# EAGLE design csgo_gsi (EAGLE 9.5.2)
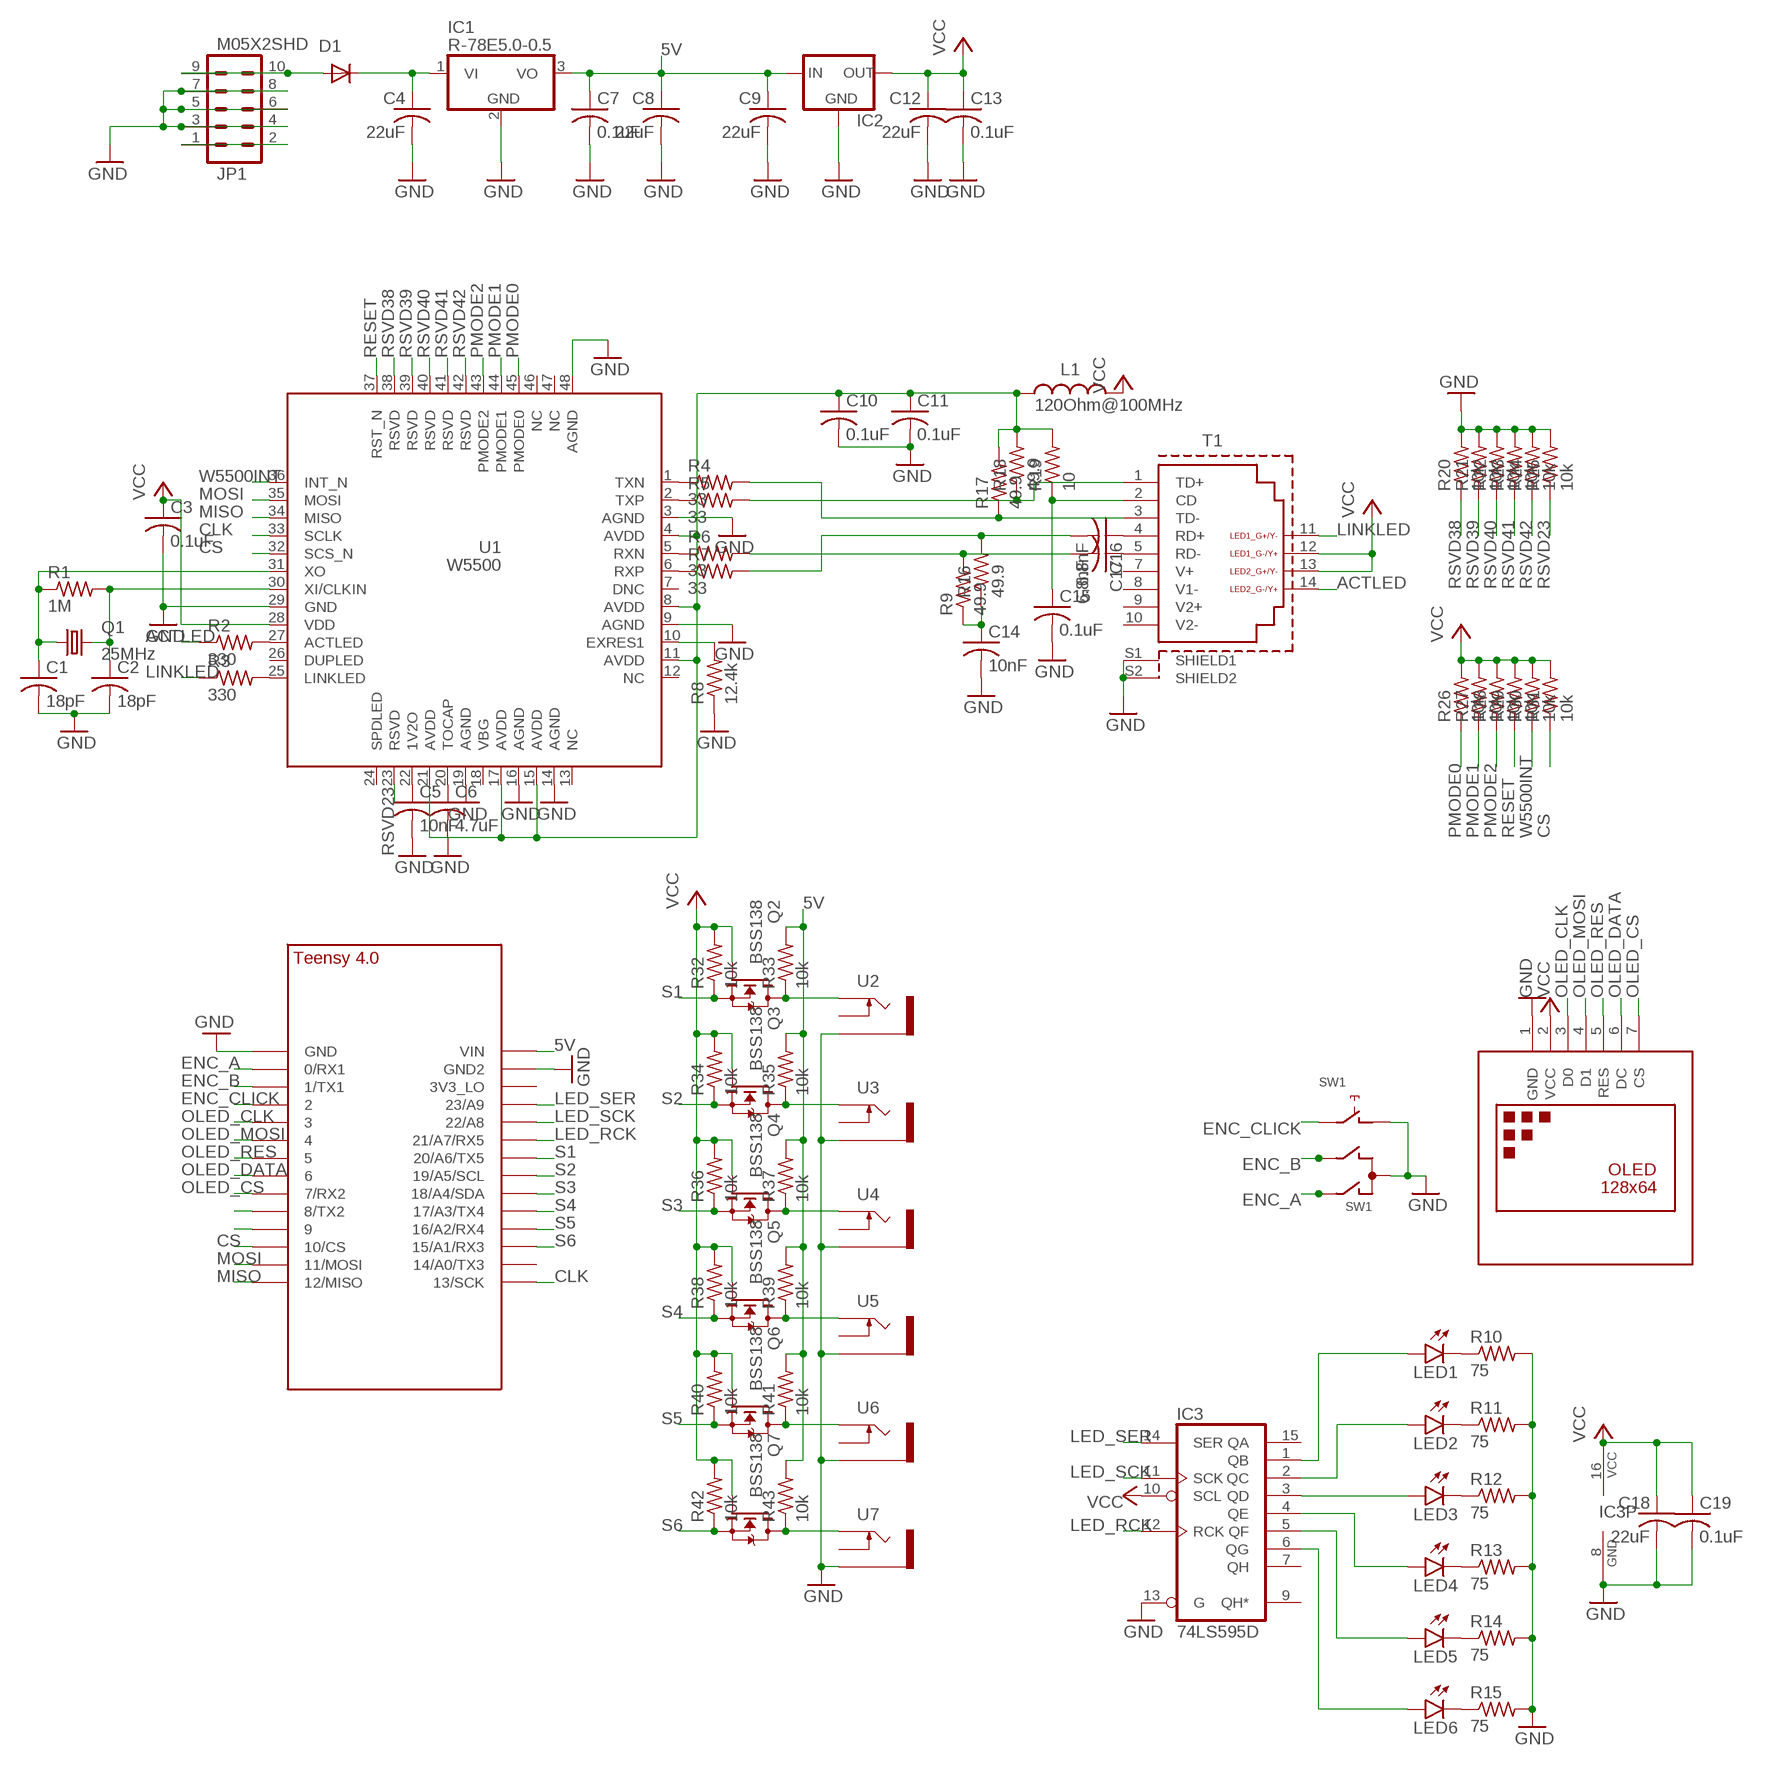
[diagram p0: schematic, sheet 1]

## Parts
C1  18pF  C-USC0603  [C0603]
C2  18pF  C-USC0603  [C0603]
C3  0.1uF  C-USC0603  [C0603]
C4  22uF  C-USC1206  [C1206]
C5  10nF  C-USC0603  [C0603]
C6  4.7uF  C-USC0603  [C0603]
C7  0.1uF  C-USC0603  [C0603]
C8  22uF  C-USC1206  [C1206]
C9  22uF  C-USC1206  [C1206]
C10  0.1uF  C-USC0603  [C0603]
C11  0.1uF  C-USC0603  [C0603]
C12  22uF  C-USC1206  [C1206]
C13  0.1uF  C-USC0603  [C0603]
C14  10nF  C-USC0603  [C0603]
C15  0.1uF  C-USC0603  [C0603]
C16  6.8nF  C-USC0603  [C0603]
C17  6.8nF  C-USC0603  [C0603]
C18  22uF  C-USC1206  [C1206]
C19  0.1uF  C-USC0603  [C0603]
D1  1N5819HW  DIODE-SOD123  [SOD123]
IC1  R-78E5.0-0.5  WE173950378  [WE78]
IC2  LM1117  [SOT223]
IC3  74LS595D  [SO16]
JP1  M05X2SHD  [2X5-SHROUDED]
L1  120Ohm@100MHz  WE-CBF_0603_74279262_WB_HS  [WE-CBF_0603(W=2.2)]
LED1  LED3MM  [LED3MM]
LED2  LED3MM  [LED3MM]
LED3  LED3MM  [LED3MM]
LED4  LED3MM  [LED3MM]
LED5  LED3MM  [LED3MM]
LED6  LED3MM  [LED3MM]
OLED1  DISPLAY-OLED-128X64  [DISPLAY-OLED-128X64]
Q1  25MHz  KX-7  [3.2X2.5_KX-7]
Q2  BSS138  [SOT23]
Q3  BSS138  [SOT23]
Q4  BSS138  [SOT23]
Q5  BSS138  [SOT23]
Q6  BSS138  [SOT23]
Q7  BSS138  [SOT23]
R1  1M  R-US_R0603  [R0603]
R2  330  R-US_R0603  [R0603]
R3  330  R-US_R0603  [R0603]
R4  33  R-US_R0603  [R0603]
R5  33  R-US_R0603  [R0603]
R6  33  R-US_R0603  [R0603]
R7  33  R-US_R0603  [R0603]
R8  12.4k  R-US_R0603  [R0603]
R9  49.9  R-US_R0603  [R0603]
R10  75  R-US_R0603  [R0603]
R11  75  R-US_R0603  [R0603]
R12  75  R-US_R0603  [R0603]
R13  75  R-US_R0603  [R0603]
R14  75  R-US_R0603  [R0603]
R15  75  R-US_R0603  [R0603]
R16  49.9  R-US_R0603  [R0603]
R17  49.9  R-US_R0603  [R0603]
R18  49.9  R-US_R0603  [R0603]
R19  10  R-US_R0603  [R0603]
R20  10k  R-US_R0603  [R0603]
R21  10k  R-US_R0603  [R0603]
R22  10k  R-US_R0603  [R0603]
R23  10k  R-US_R0603  [R0603]
R24  10k  R-US_R0603  [R0603]
R25  10k  R-US_R0603  [R0603]
R26  10k  R-US_R0603  [R0603]
R27  10k  R-US_R0603  [R0603]
R28  10k  R-US_R0603  [R0603]
R29  10k  R-US_R0603  [R0603]
R30  10k  R-US_R0603  [R0603]
R31  10k  R-US_R0603  [R0603]
R32  10k  R-US_R0603  [R0603]
R33  10k  R-US_R0603  [R0603]
R34  10k  R-US_R0603  [R0603]
R35  10k  R-US_R0603  [R0603]
R36  10k  R-US_R0603  [R0603]
R37  10k  R-US_R0603  [R0603]
R38  10k  R-US_R0603  [R0603]
R39  10k  R-US_R0603  [R0603]
R40  10k  R-US_R0603  [R0603]
R41  10k  R-US_R0603  [R0603]
R42  10k  R-US_R0603  [R0603]
R43  10k  R-US_R0603  [R0603]
SW1  Encoder  EC12E_SW  [ALPS_EC12E_SW]
T1  WE-RJ45_74984104401  [74984104401]
U1  W5500  [W5500]
U2  THONKICONNNEW  [WQP-PJ301M-12_JACK]
U3  THONKICONNNEW  [WQP-PJ301M-12_JACK]
U4  THONKICONNNEW  [WQP-PJ301M-12_JACK]
U5  THONKICONNNEW  [WQP-PJ301M-12_JACK]
U6  THONKICONNNEW  [WQP-PJ301M-12_JACK]
U7  THONKICONNNEW  [WQP-PJ301M-12_JACK]
U$1  TEENSY_4.0-BASIC  [TEENSY_4.0-BASIC]

## Nets
5V: C7.1 C8.1 C9.1 IC1.3(VO) IC2.3(IN) R33.2 R35.2 R37.2 R39.2 R41.2 R43.2 U$1.VIN
12V: C4.1 D1.C IC1.1(VI)
ACTLED: R2.1 T1.14(LED2_Y+/G-)
CLK: U1.33(SCLK) U$1.13/SCK
CS: R31.1 U1.32(SCS_N) U$1.10/CS
ENC_A: SW1.A U$1.0/RX(0/RX1)
ENC_B: SW1.B U$1.1/TX(1/TX1)
ENC_CLICK: SW1.E U$1.2
GND: C1.2 C2.2 C3.2 C4.2 C5.2 C6.2 C7.2 C8.2 C9.2 C10.2 C11.2 C12.2 C13.2 C14.2 C15.2 C18.2 C19.2 IC1.2(GND) IC2.1(GND) IC3.8(GND) IC3.13(G) JP1.3 JP1.4 JP1.5 JP1.6 JP1.7 JP1.8 OLED1.1(GND) R8.1 R10.2 R11.2 R12.2 R13.2 R14.2 R15.2 R20.2 R21.2 R22.2 R23.2 R24.2 R25.2 SW1.C SW1.D T1.S1(SHIELD1) T1.S2(SHIELD2) U1.3(AGND) U1.9(AGND) U1.14(AGND) U1.16(AGND) U1.19(AGND) U1.29(GND) U1.48(AGND) U2.P$3_SLEEVE(SLEEVE) U3.P$3_SLEEVE(SLEEVE) U4.P$3_SLEEVE(SLEEVE) U5.P$3_SLEEVE(SLEEVE) U6.P$3_SLEEVE(SLEEVE) U7.P$3_SLEEVE(SLEEVE) U$1.GND
LED1: IC3.1(QB) LED1.A
LED2: IC3.2(QC) LED2.A
LED3: IC3.3(QD) LED3.A
LED4: IC3.4(QE) LED4.A
LED5: IC3.5(QF) LED5.A
LED6: IC3.6(QG) LED6.A
LED_RCK: IC3.12(RCK) U$1.21/A7(21/A7/RX5)
LED_SCK: IC3.11(SCK) U$1.22/A8
LED_SER: IC3.14(SER) U$1.23/A9
LINKLED: R3.1 T1.11(LED1_Y-/G+)
MISO: U1.34(MISO) U$1.12/MISO
MOSI: U1.35(MOSI) U$1.11/MOSI
N$1: C5.1 U1.22(1V2O)
N$2: C6.1 U1.20(TOCAP)
N$3: R5.2 R18.1 T1.1(TD+)
N$4: R4.2 R17.1 T1.3(TD-)
N$5: R3.2 U1.25(LINKLED)
N$6: R2.2 U1.27(ACTLED)
N$7: R8.2 U1.10(EXRES1)
N$8: R4.1 U1.1(TXN)
N$9: R5.1 U1.2(TXP)
N$10: R6.1 U1.5(RXN)
N$11: R7.1 U1.6(RXP)
N$12: C16.1 T1.4(RD+)
N$13: C17.1 T1.5(RD-)
N$14: C16.2 R7.2 R16.2
N$15: C17.2 R6.2 R9.2
N$16: C14.1 R9.1 R16.1
N$17: C1.1 Q1.1 R1.1 U1.31(XO)
N$18: C15.1 R19.1 T1.2(CD)
N$19: C10.1 C11.1 L1.1 R17.2 R18.2 R19.2 U1.4(AVDD) U1.8(AVDD) U1.11(AVDD) U1.15(AVDD) U1.17(AVDD) U1.21(AVDD)
N$20: C2.1 Q1.3 R1.2 U1.30(XI/CLKIN)
N$21: U$1.GND2 ; supply symbol labelled GND
N$22: LED1.K(C) R10.1
N$23: Q2.3(D) R33.1 U2.P$1_TIP(TIP)
N$24: LED2.K(C) R11.1
N$25: Q3.3(D) R35.1 U3.P$1_TIP(TIP)
N$26: LED3.K(C) R12.1
N$27: Q4.3(D) R37.1 U4.P$1_TIP(TIP)
N$28: LED4.K(C) R13.1
N$29: Q5.3(D) R39.1 U5.P$1_TIP(TIP)
N$30: LED5.K(C) R14.1
N$31: Q6.3(D) R41.1 U6.P$1_TIP(TIP)
N$32: LED6.K(C) R15.1
N$33: Q7.3(D) R43.1 U7.P$1_TIP(TIP)
N$42: U$1.8(8/TX2)
N$43: U$1.9/CS
N$56: D1.A JP1.9 JP1.10
N$64: JP1.1 JP1.2
OLED_CLK: OLED1.3(D0) U$1.3/CANTX
OLED_CS: OLED1.7(CS) U$1.7(7/RX2)
OLED_DATA: OLED1.6(DC) U$1.6
OLED_MOSI: OLED1.4(D1) U$1.4/CANRX
OLED_RES: OLED1.5(RES) U$1.5
PMODE0: R26.1 U1.45(PMODE0)
PMODE1: R27.1 U1.44(PMODE1)
PMODE2: R28.1 U1.43(PMODE2)
RESET: R29.1 U1.37(RST_N)
RSVD23: R25.1 U1.23(RSVD)
RSVD38: R20.1 U1.38(RSVD)
RSVD39: R21.1 U1.39(RSVD)
RSVD40: R22.1 U1.40(RSVD)
RSVD41: R23.1 U1.41(RSVD)
RSVD42: R24.1 U1.42(RSVD)
S1: Q2.2(S) R32.1 U$1.20/A6(20/A6/TX5)
S2: Q3.2(S) R34.1 U$1.19/A5/SCL
S3: Q4.2(S) R36.1 U$1.18/A4/SDA
S4: Q5.2(S) R38.1 U$1.17/A3(17/A3/TX4)
S5: Q6.2(S) R40.1 U$1.16/A2(16/A2/RX4)
S6: Q7.2(S) R42.1 U$1.15/A1(15/A1/RX3)
VCC: C3.1 C12.1 C13.1 C18.1 C19.1 IC2.2(OUT) IC3.10(SCL) IC3.16(VCC) L1.2 OLED1.2(VCC) Q2.1(G) Q3.1(G) Q4.1(G) Q5.1(G) Q6.1(G) Q7.1(G) R26.2 R27.2 R28.2 R29.2 R30.2 R31.2 R32.2 R34.2 R36.2 R38.2 R40.2 R42.2 T1.12(LED1_Y+/G-) T1.13(LED2_Y-/G+) U1.28(VDD)
W5500INT: R30.1 U1.36(INT_N)
Unconnected: IC3.7(QH) IC3.9(QH*) IC3.15(QA) SW1.GND1(G) SW1.GND2(G) T1.7(V+) T1.8(V1-) T1.9(V2+) T1.10(V2-) U1.7(DNC) U1.12(NC) U1.13(NC) U1.18(VBG) U1.24(SPDLED) U1.26(DUPLED) U1.46(NC) U1.47(NC) U2.P$2_SWITCH(SWITCH) U3.P$2_SWITCH(SWITCH) U4.P$2_SWITCH(SWITCH) U5.P$2_SWITCH(SWITCH) U6.P$2_SWITCH(SWITCH) U7.P$2_SWITCH(SWITCH) U$1.3V3_LO U$1.14/A0(14/A0/TX3)

## Library data of the parts
C1-C3 C5-C7 C10 C11 C13-C17 C19 = rcl:C-US: CAPACITOR, American symbol; SPICEPREFIX: C
C4 C8 C9 C12 C18 = rcl:C-US: CAPACITOR, American symbol
D1 = diode:DIODE-: DIODE
IC1 = og-vreg:WE173950378
IC2 = v-reg-3:LM1117
IC3 = 74xx-us:74*595: 8-bit SHIFT REGISTER, output latch
JP1 = og-header:M05X2: Header 5x2 Standard 10-pin dual row 0.1" header. Commonly used with AVR-ISP. Use with Spark Fun Electronics SKU: PRT-00778
L1 = o160525v244 Eagle_WE-CBF (rev19b):WE-CBF_0603: WE-CBF SMD EMI Suppression Ferrite Bead Characteristics Reliable Ni-Sn electrodes High rated current up to 6 A Operating temperature: –55 ºC to +125 ºC Applications Perfect as data lined filter and for uncoupling of distribution voltage Package name and Variant abbreviation: Package: Wide Band /High Speed: W=Width= 2.2 High Current: W=Width= 2.6 Variant abbreviation: WB = Wide Band HS=High Speed HC=High Current <https://katalog.we-online.de/media/images/v2/o14753v209%20Family_WE-CBF.jpg> Details see: http://katalog.we-online.de/en/pbs/WE-CBF Updated by Ella Wu 2019-01-02 2019 (C) Wurth Elektronik; DATASHEET-URL: https://www.we-online.com/catalog/datasheet/74279262.pdf; IR1: 500mA; IR2: 1350mA; MOUNT: SMT; PART-NUMBER: 74279262; RDC-MAX: 0.3Ohm; TYPE: Wide Band; Z: 141Ohm@1GMHz; ZMAX: 200Ohm
LED1-LED6 = led:LED: LED OSRAM: - CHIPLED LG R971, LG N971, LY N971, LG Q971, LY Q971, LO R971, LY R971 LH N974, LH R974 LS Q976, LO Q976, LY Q976 LO Q996 - Hyper CHIPLED LW Q18S LB Q993, LB Q99A, LB R99A - SideLED LS A670, LO A670, LY A670, LG A670, LP A670 LB A673, LV A673, LT A673, LW A673 LH A674 LY A675 LS A676, LA A676, LO A676, LY A676, LW A676 LS A679, LY A679, LG A679 - Hyper Micro SIDELED® LS Y876, LA Y876, LO Y876, LY Y876 LT Y87S - SmartLED LW L88C, LW L88S LB L89C, LB L89S, LG L890 LS L89K, LO L89K, LY L89K LS L896, LA L896, LO L896, LY L896 - TOPLED LS T670, LO T670, LY T670, LG T670, LP T670 LSG T670, LSP T670, LSY T670, LOP T670, LYG T670 LG T671, LOG T671, LSG T671 LB T673, LV T673, LT T673, LW T673 LH T674 LS T676, LA T676, LO T676, LY T676, LB T676, LH T676, LSB T676, LW T676 LB T67C, LV T67C, LT T67C, LS T67K, LO T67K, LY T67K, LW E67C LS E67B, LA E67B, LO E67B, LY E67B, LB E67C, LV E67C, LT E67C LW T67C LS T679, LY T679, LG T679 LS T770, LO T770, LY T770, LG T770, LP T770 LB T773, LV T773, LT T773, LW T773 LH T774 LS E675, LA E675, LY E675, LS T675 LS T776, LA T776, LO T776, LY T776, LB T776 LHGB T686 LT T68C, LB T68C - Hyper Mini TOPLED® LB M676 - Mini TOPLED Santana® LG M470 LS M47K, LO M47K, LY M47K Source: http://www.osram.convergy.de LUXEON: - LUMILED® LXK2-PW12-R00, LXK2-PW12-S00, LXK2-PW14-U00, LXK2-PW14-V00 LXK2-PM12-R00, LXK2-PM12-S00, LXK2-PM14-U00 LXK2-PE12-Q00, LXK2-PE12-R00, LXK2-PE12-S00, LXK2-PE14-T00, LXK2-PE14-U00 LXK2-PB12-K00, LXK2-PB12-L00, LXK2-PB12-M00, LXK2-PB14-N00, LXK2-PB14-P00, LXK2-PB14-Q00 LXK2-PR12-L00, LXK2-PR12-M00, LXK2-PR14-Q00, LXK2-PR14-R00 LXK2-PD12-Q00, LXK2-PD12-R00, LXK2-PD12-S00 LXK2-PH12-R00, LXK2-PH12-S00 LXK2-PL12-P00, LXK2-PL12-Q00, LXK2-PL12-R00 Source: www.luxeon.com KINGBRIGHT: KA-3528ASYC Source: www.kingbright.com
OLED1 = diy-modules:DISPLAY-OLED-128X64: 128x64 Dot Matrix OLED Module based on SSD1306 chip Variant with SPI interface More details available here: http://www.instructables.com/id/How-to-use-OLED-display-arduino-module/ SSD1306 datasheet: https://cdn-shop.adafruit.com/datasheets/SSD1306.pdf Click here to find device on ebay.com <http://www.ebay.com/sch/oled+display+128x64> Note: There are two variants: I2C and SPI. Search for the proper version.
Q1 = crystal-geyer_V1_0:KX: Quartz Crystals (MHz) SMD: KX - Serie Model Size l/w/h [mm] Frequency Range Frequency Stability Temp. Range [°C] Load Capacitance AECQ 200 availabel Datasheet KX-4 KX-5 KX-6 KX-7 KX-9A KX-9B KX-12A KX-12B KX-13 KX-20 KX-K KX-KS 1.6/1.2/0.3 2.0/1.6/0.45 2.5/2.0/0.55 3.2/2.5/0.8 5.0/3.2/1.0 5.0/3.2/1.1 6.0/3.5/1.1 6.0/3.5/1.0 7.0/5.0 /1.3 11.6/5.5/1.6 12.3/4.5/4.2 12.3/4.5/3.2 24.0 ~ 80.0 MHz 16.0 ~ 80.0 MHz 12.0 ~ 80.0 MHz 8.0 ~ 60.0 MHz 7,68 ~ 300,0 MHz 8,0 ~ 50,0 MHz 8,0 ~ 150,0 MHz 8,0 ~ 50,0 MHz 6,0 ~ 160,0 MHz 3,579 ~ 25,0 MHz 3,579 ~ 70,0 MHz 3,579 ~ 70,0 MHz ±10 … ±50ppm ±10 … ±50ppm ±10 … ±50ppm ±10 … ±50ppm ±10 … ±50ppm ±10 … ±50ppm ±10 … ±50ppm ±10 … ±50ppm ±10 … ±50ppm ±50ppm ±10 … ±50ppm ±10 … ±50ppm (*) -40°C …+85°C (*) -40°C …+125°C (*) -40°C …+125°C (*) -40°C …+125°C (*) -40°C …+105°C (*) -40°C …+105°C (*) -40°C …+125°C (*) -40°C …+105°C (*) -40°C …+105°C (*) -40°C …+105°C (*) -40°C …+85°C (*) -40°C …+85°C 8, 8…16 8, 8…16 10, 8…16 12, 7…20 16, 10…20 16, 10…20 16, 10…20 16, 12…20 16, 12…20 16, 12…20 16, 12…30 16, 12…30 - yes yes yes - - - - - - - - KX-4.pdf <http://www.geyer-electronic.de/uploads/tx_userartikelfrequenz/GEYER-KX-4.pdf> KX-5.pdf <http://www.geyer-electronic.de/uploads/tx_userartikelfrequenz/GEYER-KX-5.pdf> KX-6.pdf <http://www.geyer-electronic.de/uploads/tx_userartikelfrequenz/GEYER-KX-6.pdf> KX-7.pdf <http://www.geyer-electronic.de/uploads/tx_userartikelfrequenz/GEYER-KX-7.pdf> KX-9A.pdf <http://www.geyer-electronic.de/uploads/tx_userartikelfrequenz/GEYER-KX-9A.pdf> KX-9B.pdf <http://www.geyer-electronic.de/uploads/tx_userartikelfrequenz/GEYER-KX-9B.pdf> KX-12A.pdf <http://www.geyer-electronic.de/uploads/tx_userartikelfrequenz/GEYER-KX-12A.pdf> KX-12B.pdf <http://www.geyer-electronic.de/uploads/tx_userartikelfrequenz/GEYER-KX-12B.pdf> KX-13.pdf <http://www.geyer-electronic.de/uploads/tx_userartikelfrequenz/GEYER-KX-13.pdf> KX-20.pdf <http://www.geyer-electronic.de/uploads/tx_userartikelfrequenz/GEYER-KX-20.pdf> KX-K.pdf <http://www.geyer-electronic.de/uploads/tx_userartikelfrequenz/GEYER-KX-K.pdf> KX-KS.pdf <http://www.geyer-electronic.de/uploads/tx_userartikelfrequenz/GEYER-KX-KS.pdf> <http://www.geyer-electronic.de/fileadmin/template/img/logo-geyer-electronic.png> Details see: http://www.geyer-electronic.de/Frequenz-Produkte.9.0.html Created 2016-06-07, Hans Locher 2016 (C) Geyer Quartz Technology KX4,KX5,KX6,KX7,KX9A,KX9B,KX12A,KX12B,KX13,KX20,KXK,KXKS;1612;2016;2520;3225;5032;6035;7050;11655;12345;1,6x1,2;2,0x1,6;2,5x2,0;3,2x2,5;5,0x3,2;6,0x3,5;7,0x5,0;11,6x5,5;12,3x4,5;12,3x4,5;1.6x1.2;2.0x1.6;2.5x2.0;3.2x2.5;5.0x3.2;6.0x3.5;7.0x5.0;11.6x5.5;12.3x4.5;12.3x4.5;
Q2-Q7 = bss138_10:BSS138: BSS138 N-Channel Logic Level Enhancement Mode Field Effect Transistor Source: http://www.fairchildsemi.com/datasheets/BS/BSS138.pdf; MF: Fairchild; MPN: BSS138; OC_FARNELL: 9845330; OC_NEWARK: 67R2009
R1-R43 = rcl:R-US_: RESISTOR, American symbol; SPICEPREFIX: R
SW1 = switch-alps:EC12E_SW: ALPS rotary Encoder EC12E series with switch
T1 = o160650v244 Eagle_WE-RJ45 (rev19b):WE-RJ45_74984104401: WE-RJ45 LAN Transformer Characteristics RJ45 Connector with integrated transformer / common mode choke Power over Ethernet up to 50 Watt and speeds up to 10 Gbit/s Available in SMD, THT and THT with USB Compliant with standards: IEEE 802.3u, IEEE 802.3ab, IEEE 802.3af, IEEE 802.3at, IEEE 802.3an and upcoming IEE 802.3bt Applications Suitable for industrial temperatures from –40 °C up to +85 °C Compatible to Industrial Ethernet systems like EtherCAT or Profinet Compliant with most IC’s for Ethernet applications such as Microchip, Texas Instruments, Broadcom, Linear Technology Hubs, Routers, Switches, IP cameras, IoT applications <https://katalog.we-online.com/media/images/v2/o35731v209%20Family_WE-RJ45-LAN.jpg> Details see: https://katalog.we-online.com/en/pbs/WE-LAN-RJ45 Updated by Ella Wu 2019-11-06 2019 (C) Wurth Elektronik; DATA-RATE: 10/100 Base-T; DATASHEET-URL: https://katalog.we-online.com/pbs/datasheet/74984104401.pdf; LED: yellow/green-yellow/green; MOUNT: THR; PART-NUMBER: 74984104401; POE: 1; PORTS: PoE+ (up to 600 mA); SPICEPREFIX: X; USB: No
U1 = W5500:W5500
U2-U7 = MusicThingModular:THONKICONN: 3.5mm socket for Eurorack modular synths
U$1 = Teensy-4.0:TEENSY_4.0-BASIC

## Board
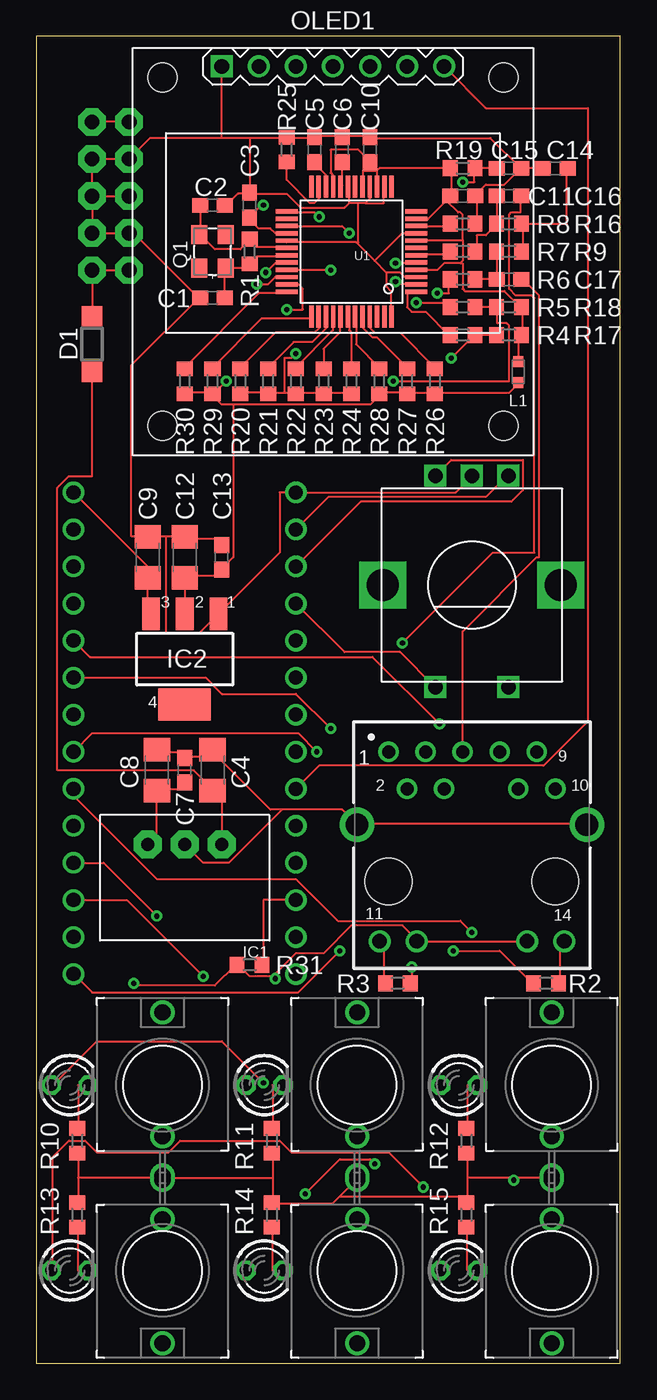
[diagram p1: board, top side]
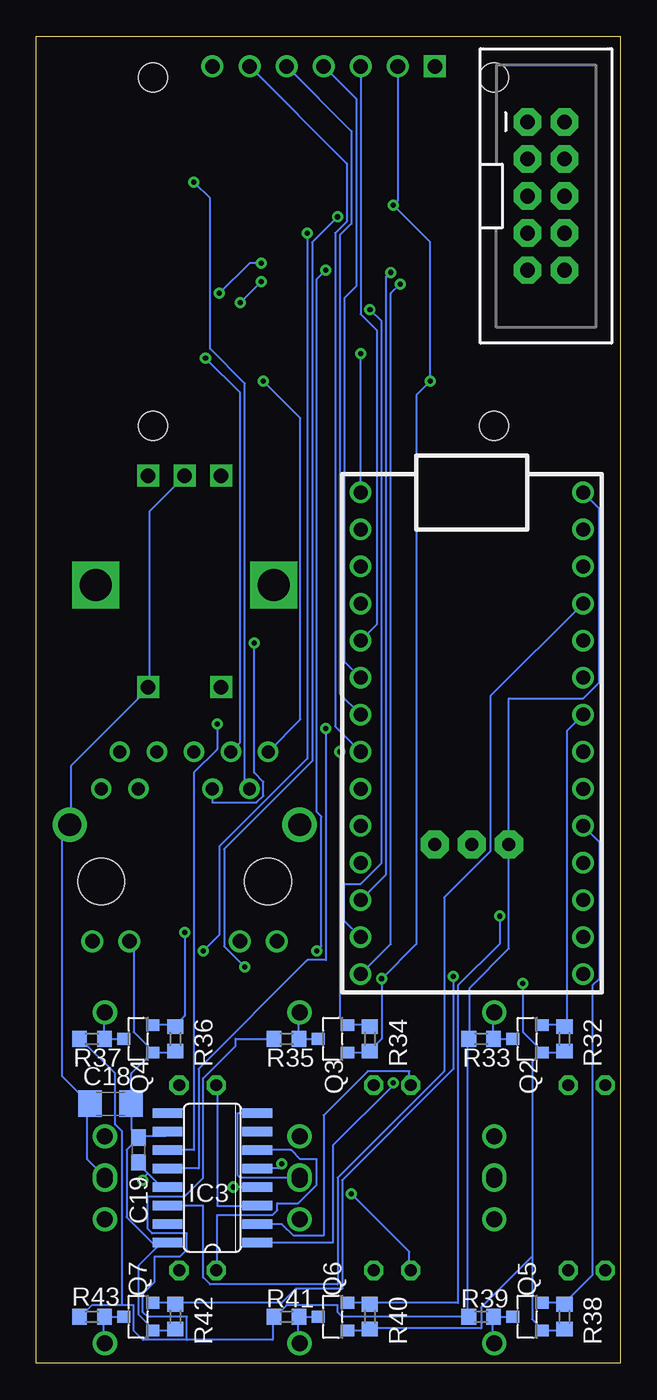
[diagram p2: board, bottom side, seen from below]

Size 40 x 90.95 mm. Coordinates in mm from the lower left corner, seen from the top.
Outline: 0,0 40,0 40,90.95 0,90.95 0,0
Copper layers (1*16): Top 0.035mm / dielectric 1.5mm / Bottom 0.035mm
Design rules "default": minimum track width 6mil, minimum drill 0.35mm, track to track 6mil, track to pad 6mil, pad to pad 6mil, via to via 6mil, smd to smd 6mil, copper to edge 40mil, drill to drill 6mil, minimum pad ring 10mil, minimum via ring 8mil, stop-mask expansion 4mil, vias tented up to drill 0mil, thermal gap 10mil

### Footprints (pad centres in the part's own frame; a part is rotated, then mirrored left to right if it is on the bottom)
C0603 = smd 1.1 x 1: 1 -0.85,0; 2 0.85,0
C1206 = smd 1.6 x 1.8: 1 -1.4,0; 2 1.4,0
SOD123 = smd 1.4 x 1.4: A 1.9,0; C -1.9,0
WE78 = drill 0.9 pad 1.93 octagon: 1 -2.54,0; 2 0,0; 3 2.54,0
SOT223 = smd 1.219 x 2.235: 1 -2.311,-3.099; 2 0,-3.099; 3 2.311,-3.099 | smd 3.6 x 2.2: 4 0,3.099
SO16 = smd 0.66 x 2.032: 1 -4.445,-3.073; 2 -3.175,-3.073; 3 -1.905,-3.073; 4 -0.635,-3.073; 5 0.635,-3.073; 6 1.905,-3.073; 7 3.175,-3.073; 8 4.445,-3.073; 9 4.445,3.073; 10 3.175,3.073; 11 1.905,3.073; 12 0.635,3.073; 13 -0.635,3.073; 14 -1.905,3.073; 15 -3.175,3.073; 16 -4.445,3.073
2X5-SHROUDED = drill 1.016 pad 1.88 octagon: 1 -1.27,5.08; 2 1.27,5.08; 3 -1.27,2.54; 4 1.27,2.54; 5 -1.27,0; 6 1.27,0; 7 -1.27,-2.54; 8 1.27,-2.54; 9 -1.27,-5.08; 10 1.27,-5.08
WE-CBF_0603(W=2.2) = smd 0.75 x 0.7: 1 -0.725,0; 2 0.725,0
LED3MM = drill 0.813 octagon: A -1.27,0; K 1.27,0
DISPLAY-OLED-128X64 = drill 1 square: 1 -7.62,12.7 | drill 1: 2 -5.08,12.7; 3 -2.54,12.7; 4 0,12.7; 5 2.54,12.7; 6 5.08,12.7; 7 7.62,12.7 | hole 2: -11.684,11.938; 11.684,11.938; 11.684,-11.938; -11.684,-11.938
3.2X2.5_KX-7 = smd 1.3 x 1.1: 1 -1.15,-0.9; 2 1.15,-0.9; 3 1.15,0.9; 4 -1.15,0.9
SOT23 = smd 0.8 x 0.9: 1 -0.95,-1; 2 0.95,-1; 3 0,1
R0603 = smd 1 x 1.1: 1 -0.85,0; 2 0.85,0
ALPS_EC12E_SW = drill 1 square: A -2.5,-7.5; B 2.5,-7.5; C 0,-7.5; D -2.5,7; E 2.5,7 | drill 2.2 square: GND1 -6.1,0; GND2 6.1,0
74984104401 = drill 0.89: 1 5.715,-8.89; 2 4.445,-6.35; 3 3.175,-8.89; 4 1.905,-6.35; 5 0.635,-8.89; 7 -1.905,-8.89; 8 -3.175,-6.35; 9 -4.445,-8.89; 10 -5.715,-6.35 | drill 1: 11 6.325,4.11; 12 3.785,4.11; 13 -3.785,4.11; 14 -6.325,4.11 | drill 1.57: S1 7.875,-3.89; S2 -7.875,-3.89 | hole 3.2: 5.715,0; -5.715,0
W5500 = smd 1.5 x 0.3: 1 -4.45,2.75; 2 -4.45,2.25; 3 -4.45,1.75; 4 -4.45,1.25; 5 -4.45,0.75; 6 -4.45,0.25; 7 -4.45,-0.25; 8 -4.45,-0.75; 9 -4.45,-1.25; 10 -4.45,-1.75; 11 -4.45,-2.25; 12 -4.45,-2.75; 25 4.45,-2.75; 26 4.45,-2.25; 27 4.45,-1.75; 28 4.45,-1.25; 29 4.45,-0.75; 30 4.45,-0.25; 31 4.45,0.25; 32 4.45,0.75; 33 4.45,1.25; 34 4.45,1.75; 35 4.45,2.25; 36 4.45,2.75 | smd 0.3 x 1.5: 13 -2.75,-4.45; 14 -2.25,-4.45; 15 -1.75,-4.45; 16 -1.25,-4.45; 17 -0.75,-4.45; 18 -0.25,-4.45; 19 0.25,-4.45; 20 0.75,-4.45; 21 1.25,-4.45; 22 1.75,-4.45; 23 2.25,-4.45; 24 2.75,-4.45; 37 2.75,4.45; 38 2.25,4.45; 39 1.75,4.45; 40 1.25,4.45; 41 0.75,4.45; 42 0.25,4.45; 43 -0.25,4.45; 44 -0.75,4.45; 45 -1.25,4.45; 46 -1.75,4.45; 47 -2.25,4.45; 48 -2.75,4.45
WQP-PJ301M-12_JACK = drill 1.1: P$1_TIP 0,5; P$2_SWITCH 0,-3.5; P$3_SLEEVE 0,-6.5
TEENSY_4.0-BASIC = drill 0.965: 0/RX -13.97,-7.62; 1/TX -11.43,-7.62; 2 -8.89,-7.62; 3/CANTX -6.35,-7.62; 3V3_LO -11.43,7.62; 4/CANRX -3.81,-7.62; 5 -1.27,-7.62; 6 1.27,-7.62; 7 3.81,-7.62; 8 6.35,-7.62; 9/CS 8.89,-7.62; 10/CS 11.43,-7.62; 11/MOSI 13.97,-7.62; 12/MISO 16.51,-7.62; 13/SCK 16.51,7.62; 14/A0 13.97,7.62; 15/A1 11.43,7.62; 16/A2 8.89,7.62; 17/A3 6.35,7.62; 18/A4/SDA 3.81,7.62; 19/A5/SCL 1.27,7.62; 20/A6 -1.27,7.62; 21/A7 -3.81,7.62; 22/A8 -6.35,7.62; 23/A9 -8.89,7.62; GND -16.51,-7.62; GND2 -13.97,7.62; VIN -16.51,7.62

### Placement (x,y rotation side)
C1  12.06,73.03 180 top
C2  12.06,79.38 0 top
C3  14.61,79.38 90 top
C4  12.06,40.64 90 top
C5  19.05,83.19 90 top
C6  20.95,83.19 90 top
C7  10.16,40.64 90 top
C8  8.26,40.64 90 top
C9  7.62,55.24 90 top
C10  22.86,83.19 90 top
C11  29.21,80.01 0 top
C12  10.16,55.24 90 top
C13  12.7,55.24 90 top
C14  35.56,81.92 180 top
C15  32.38,81.92 0 top
C16  32.38,80.01 180 top
C17  32.38,74.3 180 top
C18  34.92,17.78 180 bottom
C19  33.02,14.61 270 bottom
D1  3.81,69.85 90 top
IC1  10.16,35.56 180 top
IC2  10.16,48.26 180 top
IC3  27.94,12.7 90 bottom
JP1  5.08,80.01 0 bottom
L1  33.02,67.94 270 top
LED1  2.29,19.05 0 top
LED2  15.62,19.05 0 top
LED3  28.96,19.05 0 top
LED4  2.29,6.35 0 top
LED5  15.62,6.35 0 top
LED6  28.96,6.35 0 top
OLED1  20.32,76.2 0 top
Q1  12.06,76.2 90 top
Q2  6.35,22.23 90 bottom
Q3  19.68,22.23 90 bottom
Q4  33.02,22.23 90 bottom
Q5  6.35,3.17 90 bottom
Q6  19.68,3.17 90 bottom
Q7  33.02,3.17 90 bottom
R1  14.61,76.2 90 top
R2  34.92,26.04 180 top
R3  24.77,26.04 0 top
R4  29.21,70.48 0 top
R5  29.21,72.39 0 top
R6  29.21,74.3 0 top
R7  29.21,76.2 0 top
R8  29.21,78.11 180 top
R9  32.38,76.2 180 top
R10  2.79,15.24 270 top
R11  16.13,15.24 270 top
R12  29.46,15.24 270 top
R13  2.79,10.16 90 top
R14  16.13,10.16 90 top
R15  29.46,10.16 90 top
R16  32.38,78.11 180 top
R17  32.38,70.48 0 top
R18  32.38,72.39 0 top
R19  29.21,81.92 180 top
R20  13.97,67.31 270 top
R21  15.88,67.31 270 top
R22  17.78,67.31 270 top
R23  19.68,67.31 270 top
R24  21.59,67.31 270 top
R25  17.14,83.19 90 top
R26  27.3,67.31 270 top
R27  25.4,67.31 270 top
R28  23.5,67.31 270 top
R29  12.06,67.31 270 top
R30  10.16,67.31 270 top
R31  14.61,27.3 180 top
R32  3.81,22.23 270 bottom
R33  9.53,22.23 180 bottom
R34  17.14,22.23 270 bottom
R35  22.86,22.23 180 bottom
R36  30.48,22.23 270 bottom
R37  36.2,22.23 180 bottom
R38  3.81,3.17 270 bottom
R39  9.53,3.17 180 bottom
R40  17.14,3.17 270 bottom
R41  22.86,3.17 180 bottom
R42  30.48,3.17 270 bottom
R43  36.2,3.17 180 bottom
SW1  29.84,53.34 180 top
T1  29.84,33.02 180 top
U1  21.59,76.2 180 top
U2  8.64,19.05 0 top
U3  21.97,19.05 0 top
U4  35.31,19.05 0 top
U5  8.64,6.35 180 top
U6  21.97,6.35 180 top
U7  35.31,6.35 180 top
U$1  10.16,43.18 270 bottom

### Tracks (layer width: path | path; a pad name or v marks a point on that pad's centre or on a via)
5V
  Top 0.152: IC2.3 7.78,51.44 7.62,51.44 C9.1 7.62,54.61 U$1.VIN | C7.1 10.16,39.69 9.84,39.37 8.26,39.37 C8.1 8.26,35.56 IC1.3
  Bottom 0.152: 10.48,3.17 10.48,22.23 R33.2 10.32,22.23 10.32,25.72 7.62,28.42 IC1.3 7.62,45.56 2.54,45.56 1.43,46.67 1.43,58.58 U$1.VIN | 10.48,3.17 19.05,3.17 19.37,3.49 19.37,3.97 22.86,3.97 23.65,3.17 R41.2 23.81,3.17 23.81,1.59 29.69,1.59 | 10.48,3.17 R39.2 | 34.13,3.97 33.34,3.97 33.34,2.22 32.7,1.59 29.69,1.59 | 34.13,3.97 36.2,3.97 36.99,3.17 R43.2 | R35.2 26.35,22.23 26.35,21.75 28.57,19.53 28.57,12.7 29.84,11.43 32.38,11.43 32.38,9.21 32.07,8.89 29.69,8.89 29.69,7.78 30.16,7.3 31.91,7.3 31.91,5.56 32.7,4.76 32.7,3.49 32.38,3.17 29.69,3.17 29.69,1.59 | 34.13,3.97 34.13,15.88 34.61,16.35 34.61,19.84 36.99,22.23 R37.2
12V
  Top 0.152: D1.C 3.81,60.8 2.22,60.8 1.43,60.01 1.43,40.64 10.79,40.64 12.06,39.37 C4.1 12.06,39.21 12.7,39.21 IC1.1
ACTLED
  Top 0.152: R2.1 35.88,26.04 35.88,28.89 36.04,28.89 T1.14
CLK  (via drill 0.35)
  Top 0.152: v20.16,74.93 17.14,74.93 U1.33 | v20.8,28.26 17.94,25.4 3.81,25.4 U$1.13/SCK
  Bottom 0.152: v20.16,74.93 20.8,74.3 20.8,37.78 20.48,37.47 20.48,28.57 v20.8,28.26
CS  (via drill 0.35)
  Top 0.152: U$1.10/CS 15.56,31.75 15.56,27.3 R31.1 | v15.72,74.77 16.35,75.41 16.99,75.41 U1.32
  Bottom 0.152: v15.72,74.77 16.03,74.45 16.03,33.5 U$1.10/CS
ENC_A
  Top 0.152: U$1.0/RX 20,59.37 30.8,59.37 32.23,60.8 SW1.A
ENC_B
  Top 0.152: U$1.1/TX 22.23,59.05 32.54,59.05 33.34,59.85 33.34,61.91 28.42,61.91 27.46,60.96 SW1.B
ENC_CLICK
  Top 0.152: U$1.2 21.11,48.74 24.92,48.74 27.3,46.35 SW1.E
GND  (via drill 0.35)
  Top 0.152: 11.11,73.03 6.67,77.47 JP1.7 JP1.8 JP1.6 | JP1.6 JP1.5 | JP1.6 JP1.4 JP1.3 7.78,83.98 12.7,83.98 | 21.43,79.53 21.43,80.64 U1.19 | 22.54,79.53 22.07,79.53 | 22.07,79.53 21.43,79.53 | 22.54,79.53 22.86,79.85 22.86,80.64 U1.16 | 22.54,79.53 23.81,79.53 23.81,80.64 U1.14 | 23.97,74.77 23.97,73.82 24.29,73.5 24.29,71.75 U1.48 | 23.97,74.77 24.92,74.77 25.24,74.45 U1.3 | 21.91,76.83 17.14,76.83 U1.29 | 23.97,74.77 23.18,75.56 | 23.18,75.56 21.91,76.83 | 23.18,75.56 25.08,77.47 26.04,77.47 U1.9 | 22.07,79.53 22.07,76.83 21.91,76.83 | C14.2 C15.2 33.18,81.92 | R8.1 30.16,78.11 30.16,80.01 C11.2 30,80.01 30.8,80.8 32.07,80.8 33.18,81.92 | 14.61,80.17 13.81,80.17 13.02,79.38 C2.2 | 17.14,83.98 19.05,83.98 C5.2 19.05,84.14 20.95,84.14 | 20.95,84.14 22.86,84.14 C10.2 22.86,83.98 31.11,83.98 33.18,81.92 | 20.95,84.14 C6.2 | 14.61,83.98 C3.2 14.61,80.17 | 17.14,83.98 14.61,83.98 | 17.14,83.98 R25.2 | 12.7,83.98 OLED1.1 | 14.61,83.98 12.7,83.98 | 21.43,79.53 21.11,79.22 18.1,79.22 17.14,80.17 14.61,80.17 | 15.88,66.52 13.97,66.52 R20.2 | 15.88,66.52 16.99,66.52 | 16.99,66.52 17.78,66.52 | 15.88,66.52 R21.2 | 17.78,66.52 19.68,66.52 | 17.78,66.52 R22.2 | 19.68,66.52 21.59,66.52 R24.2 | 19.68,66.52 R23.2 | C13.2 12.7,56.2 12.38,56.52 10.16,56.52 C12.2 10.16,56.67 8.89,56.67 | 8.89,56.67 7.62,56.67 | SW1.C 29.84,60.8 28.73,59.69 U$1.GND 16.67,59.69 16.67,55.56 12.54,51.44 IC2.1 12.38,51.28 11.11,50.01 8.89,50.01 8.89,56.67 | 16.99,66.52 16.99,68.9 17.46,68.9 v17.78,69.22 | 29.53,12.7 29.53,14.29 R12.2 | 29.53,12.7 29.53,11.11 R15.2 29.37,11.11 29.05,11.43 20.8,11.43 | 32.7,12.7 35.24,12.7 U4.P$3_SLEEVE | 32.7,12.7 29.53,12.7
  Top 0.152: 32.7,12.7 v32.7,12.54 | U6.P$3_SLEEVE 22.07,12.7 U3.P$3_SLEEVE 21.91,12.54 20.8,11.43 | 16.19,12.7 16.19,14.29 R11.2 | 16.19,12.7 16.19,11.11 R14.2 16.19,10.95 20.32,10.95 20.8,11.43 | 2.86,12.7 2.86,14.29 R10.2 | 2.86,12.7 2.86,11.11 R13.2 | 2.86,12.7 8.57,12.7 U5.P$3_SLEEVE 8.73,12.7 | 8.73,12.7 16.19,12.7 | 8.73,12.7 U2.P$3_SLEEVE | 10.16,41.59 9.84,41.91 8.26,41.91 C8.2 | 12.06,41.91 11.75,41.59 10.16,41.59 | 10.16,41.59 C7.2 | 12.06,41.91 16.03,37.94 16.83,37.94 | 16.83,37.94 20.95,37.94 21.91,36.99 T1.S1 22.07,36.99 37.62,36.99 T1.S2 | 12.06,41.91 C4.2 | IC1.2 11.43,34.29 13.18,34.29 16.83,37.94 | 11.11,73.03 6.51,68.42 6.51,56.67 7.62,56.67 | 11.11,73.03 C1.2 | 7.62,56.67 C9.2
  Bottom 0.152: U$1.GND v17.78,69.22 | 32.38,13.02 31.43,12.06 IC3.13 | 32.38,13.02 33.02,13.65 C19.2 | 36.35,17.78 36.51,17.62 36.51,13.97 35.4,12.86 | 32.38,13.02 32.7,12.7 v32.7,12.54 | 35.4,12.86 U7.P$3_SLEEVE | 35.4,12.86 U4.P$3_SLEEVE | IC3.8 26.19,17.14 26.19,12.86 26.04,12.7 22.07,12.7 U6.P$3_SLEEVE | 36.35,17.78 38.26,19.68 38.26,36.35 37.78,36.83 T1.S2 37.62,36.99 37.62,40.96 32.38,46.2 SW1.D 32.23,46.35 32.23,58.42 29.84,60.8 SW1.C | 36.35,17.78 C18.2
LED1  (via drill 0.35)
  Top 0.152: v15.56,19.21 12.7,22.07 4.13,22.07 1.11,19.05 LED1.A
  Bottom 0.152: IC3.1 19.68,8.26 19.68,14.92 15.56,19.05 v15.56,19.21
LED2
  Bottom 0.152: IC3.2 23.18,9.53 22.38,8.73 20.32,8.73 20.32,16.99 17.3,20 14.45,20 14.45,19.05 LED2.A
LED3
  Bottom 0.152: IC3.3 27.62,10.79 27.62,19.05 LED3.A
LED4  (via drill 0.35)
  Top 0.152: v26.51,12.06 24.13,14.45 17.46,14.45 16.67,15.24 9.84,15.24 9.05,14.45 4.13,14.45 3.33,15.24 2.22,15.24 1.11,14.13 1.11,6.35 LED4.A
  Bottom 0.152: v26.51,12.06 IC3.4
LED5  (via drill 0.35)
  Top 0.152: v23.18,13.65 22.86,13.97 20.8,13.97 v18.41,11.59
  Bottom 0.152: IC3.5 23.18,13.34 v23.18,13.65 | v18.41,11.59 14.45,7.62 14.45,6.35 LED5.A
LED6
  Bottom 0.152: IC3.6 22.54,14.61 21.91,13.97 20.8,13.97 20.8,12.22 22.07,10.95 23.5,10.95 23.5,10.48 23.81,10.16 27.62,10.16 27.62,6.35 LED6.A
LED_RCK  (via drill 0.35)
  Top 0.152: v20.16,43.5 17.78,45.88 12.7,45.88 11.59,46.99 U$1.21/A7
  Bottom 0.152: IC3.12 28.89,13.34 28.89,20.16 21.43,27.62 20.16,27.62 v20.16,43.5
LED_SCK  (via drill 0.35)
  Top 0.152: v27.62,43.81 23.02,48.42 3.65,48.42 U$1.22/A8
  Bottom 0.152: IC3.11 29.21,14.61 29.21,40.48 27.62,42.07 v27.62,43.81
LED_SER
  Bottom 0.152: IC3.14 28.57,10.79 28.57,5.87 28.1,5.4 19.37,5.4 19.37,12.7 12.06,20 12.06,31.91 8.89,35.08 8.89,45.72 U$1.23/A9
LINKLED
  Top 0.152: R3.1 23.81,26.04 23.81,28.89 23.65,28.89 T1.11
MISO  (via drill 0.35)
  Top 0.152: v15.08,73.98 15.88,73.98 16.35,74.45 16.99,74.45 U1.34
  Bottom 0.152: v15.08,73.98 15.72,73.34 15.72,28.73 U$1.12/MISO
MOSI  (via drill 0.35)
  Top 0.152: v17.14,72.23 18.26,72.23 18.26,73.66 17.94,73.98 17.14,73.98 U1.35
  Bottom 0.152: v17.14,72.23 16.35,71.44 16.35,34.29 17.78,32.86 18.89,32.86 18.89,30.32 U$1.11/MOSI
N$1
  Top 0.152: C5.1 19.05,82.23 19.84,81.44 19.84,80.8 U1.22
N$2
  Top 0.152: C6.1 20.95,80.8 U1.20
N$3  (via drill 0.35)
  Top 0.152: R5.2 R18.1 31.59,72.39 31.59,71.28 32.23,71.28 32.38,71.12 32.38,67.31 v24.45,67.31
  Bottom 0.152: v24.45,67.31 21.91,64.77 21.91,44.13 T1.1
N$4  (via drill 0.35)
  Top 0.152: R17.1 R4.2 30,70.48 v28.42,68.9
  Bottom 0.152: v28.42,68.9 26.04,66.52 26.04,42.55 T1.3
N$5  (via drill 0.35)
  Top 0.152: v25.72,27.15 25.72,26.04 R3.2 | v19.37,78.58 19.05,78.9 17.14,78.9 U1.25
  Bottom 0.152: v25.72,27.15 27.15,28.57 27.15,35.24 21.11,41.27 21.11,76.83 v19.37,78.58
N$6  (via drill 0.35)
  Top 0.152: v28.57,28.26 31.75,28.26 33.97,26.04 R2.2 | v21.43,77.47 20.95,77.95 U1.27
  Bottom 0.152: v28.57,28.26 27.46,29.37 27.46,35.4 21.43,41.43 v21.43,77.47
N$7
  Top 0.152: R8.2 28.26,78.11 28.1,77.95 26.19,77.95 U1.10
N$8
  Top 0.152: R4.1 28.26,70.48 26.67,72.07 25.72,72.07 25.4,72.39 25.4,73.34 26.04,73.34 U1.1
N$9  (via drill 0.35)
  Top 0.152: v26.04,72.71 27.94,72.71 28.26,72.39 R5.1 | v24.61,74.14 24.77,73.98 26.04,73.98 U1.2
  Bottom 0.152: v24.61,74.14 v26.04,72.71
N$10  (via drill 0.35)
  Top 0.152: v27.46,73.34 28.26,73.34 28.26,74.3 R6.1 | v24.61,75.41 26.04,75.41 U1.5
  Bottom 0.152: v27.46,73.34 25.4,75.41 v24.61,75.41
N$11
  Top 0.152: R7.1 28.26,76.2 28.1,76.04 26.19,76.04 U1.6
N$12  (via drill 0.35)
  Top 0.152: v25.08,49.37 31.27,55.56 34.13,55.56 34.13,73.03 33.97,73.18 32.86,73.18 32.38,73.66 32.38,78.74 32.54,78.9 33.18,78.9 33.18,80.01 C16.1
  Bottom 0.152: v25.08,49.37 25.08,40.48 24.45,39.85 24.45,38.89 24.92,38.42 27.94,38.42 T1.4
N$13
  Top 0.152: T1.5 29.21,50.16 34.29,55.24 34.45,55.24 34.45,73.18 33.34,74.3 C17.1
N$14
  Top 0.152: 31.59,78.11 30.8,77.31 30.16,77.31 30.16,76.2 R7.2 | 31.59,78.11 31.59,80.01 C16.2 | 31.59,78.11 R16.2
N$15
  Top 0.152: R6.2 C17.2 31.59,74.3 31.59,76.2 R9.2
N$16
  Top 0.152: 33.34,78.11 33.34,76.2 R9.1 | 33.34,78.11 36.35,78.11 36.35,81.92 C14.1 | 33.34,78.11 R16.1
N$17
  Top 0.152: C1.1 12.86,73.03 12.86,74.93 Q1.1 13.02,75.09 14.45,75.09 14.61,75.25 R1.1 14.61,75.41 15.08,75.88 16.99,75.88 U1.31
N$18  (via drill 0.35)
  Top 0.152: C15.1 R19.1 30,81.92 30,80.96 v29.21,80.96
  Bottom 0.152: v29.21,80.96 28.1,79.85 28.1,69.53 25.72,67.15 25.72,39.69 T1.2
N$19
  Top 0.152: 22.38,81.76 22.86,82.23 C10.1 22.86,82.39 22.07,83.19 20.16,83.19 20.16,81.6 20.32,81.44 20.32,80.8 U1.21 | 22.38,81.76 22.38,80.8 U1.17 | 23.34,81.76 23.34,80.8 U1.15 | 22.38,81.76 23.34,81.76 | 28.42,80.01 28.42,81.92 R19.2 23.5,81.92 23.34,81.76 | 28.42,80.01 28.1,79.69 | 28.1,79.69 26.83,78.42 26.19,78.42 U1.11 | 28.42,80.01 C11.1 28.1,79.69 | L1.1 33.02,70.48 R17.2 33.34,70.48 33.34,72.39 R18.2 33.18,72.39 32.07,73.5 29.37,73.5 29.21,73.66 29.21,75.41 29.05,75.41 | 29.05,75.41 27.94,75.41 27.46,74.93 26.19,74.93 U1.4 | 29.05,75.41 29.21,75.56 29.21,76.99 | 29.21,76.99 26.19,76.99 U1.8 | 28.1,79.69 28.89,78.9 29.05,78.9 29.21,78.74 29.21,76.99
N$20
  Top 0.152: C2.1 11.27,79.38 11.27,77.47 Q1.3 11.27,77.31 12.22,76.36 13.97,76.36 14.61,76.99 | 14.61,76.99 15.08,76.52 16.99,76.52 U1.30 | 14.61,76.99 R1.2
N$22
  Top 0.152: LED1.K 2.86,19.05 2.86,16.19 R10.1
N$23
  Bottom 0.152: Q2.3 R33.1 8.73,22.23 8.73,23.97 U2.P$1_TIP
N$24
  Top 0.152: LED2.K 16.19,19.05 16.19,16.19 R11.1
N$25
  Bottom 0.152: Q3.3 R35.1 22.07,22.23 22.07,23.97 U3.P$1_TIP
N$26
  Top 0.152: LED3.K 29.53,19.05 29.53,16.19 R12.1
N$27
  Bottom 0.152: Q4.3 R37.1 35.4,22.23 35.4,23.97 U4.P$1_TIP
N$28
  Top 0.152: LED4.K 2.86,6.35 2.86,9.21 R13.1
N$29
  Bottom 0.152: Q5.3 R39.1 8.73,3.17 8.73,1.43 U5.P$1_TIP
N$30
  Top 0.152: LED5.K 16.19,6.35 16.19,9.21 R14.1
N$31
  Bottom 0.152: Q6.3 R41.1 22.07,3.17 22.07,1.43 U6.P$1_TIP
N$32
  Top 0.152: LED6.K 29.53,6.35 29.53,9.21 R15.1
N$33
  Bottom 0.152: Q7.3 R43.1 35.4,3.17 35.4,1.43 U7.P$1_TIP
N$56
  Top 0.152: D1.A JP1.10 JP1.9
N$64
  Top 0.152: JP1.1 JP1.2
OLED_CLK
  Bottom 0.152: U$1.3/CANTX 16.67,50.64 16.67,70.8 17.78,71.91 OLED1.3
OLED_CS
  Top 0.152: U$1.7 19.37,40.96 34.77,40.96 37.78,43.97 37.78,86.04 30.8,86.04 OLED1.7
OLED_DATA
  Bottom 0.152: U$1.6 19.53,43.66 19.53,77.47 18.73,78.26 18.73,82.23 OLED1.6
OLED_MOSI
  Bottom 0.152: U$1.4/CANRX 18.89,48.1 18.89,73.03 18.1,73.82 18.1,86.68 OLED1.4
OLED_RES
  Bottom 0.152: U$1.5 19.21,45.88 19.21,77.31 18.41,78.11 18.41,84.45 OLED1.5
PMODE0
  Top 0.152: R26.1 27.3,68.26 24.92,70.64 23.18,70.64 22.86,70.96 22.86,71.6 U1.45
PMODE1
  Top 0.152: R27.1 25.4,68.26 23.34,70.33 23.02,70.33 22.38,70.96 22.38,71.6 U1.44
PMODE2
  Top 0.152: R28.1 23.5,68.26 21.91,69.85 21.91,71.6 U1.43
RESET
  Top 0.152: R29.1 12.06,68.26 15.4,71.6 18.73,71.6 U1.37
RSVD23
  Top 0.152: R25.1 17.14,81.12 18.73,79.53 19.05,79.53 19.37,79.85 19.37,80.64 U1.23
RSVD38
  Top 0.152: R20.1 13.97,68.26 16.35,70.64 19.05,70.64 19.37,70.96 19.37,71.6 U1.38
RSVD39
  Top 0.152: R21.1 15.88,68.26 17.62,70.01 18.89,70.01 19.84,70.96 19.84,71.6 U1.39
RSVD40
  Top 0.152: R22.1 17.78,68.26 20.32,70.8 20.32,71.6 U1.40
RSVD41
  Top 0.152: R23.1 19.68,69.53 20.8,70.64 20.8,71.6 U1.41
RSVD42
  Top 0.152: R24.1 21.59,70.64 21.43,70.8 21.43,71.6 U1.42
S1
  Bottom 0.152: 3.81,23.18 5.24,23.18 Q2.2 | 3.81,23.18 3.65,23.34 3.65,43.34 U$1.20/A6 | 3.81,23.18 R32.1
S2  (via drill 0.35)
  Top 0.152: v19.21,41.91 17.94,43.18 3.81,43.18 U$1.19/A5/SCL
  Bottom 0.152: R34.1 17.14,23.18 18.57,23.18 Q3.2 18.73,23.18 19.21,23.65 v19.21,41.91
S3  (via drill 0.35)
  Top 0.152: v29.84,29.53 29.05,30.32 20.64,30.32 17.78,33.18 8.26,33.18 2.54,38.89 U$1.18/A4/SDA
  Bottom 0.152: 30.48,23.18 31.91,23.18 Q4.2 | 30.48,23.18 29.84,23.81 v29.84,29.53 | 30.48,23.18 R36.1
S4
  Bottom 0.152: 3.81,4.13 5.24,4.13 Q5.2 | 3.81,4.13 1.91,6.03 1.91,25.88 1.43,26.35 1.43,35.72 U$1.17/A3 | 3.81,4.13 R38.1
S5  (via drill 0.35)
  Top 0.152: v8.26,30.64 4.6,34.29 U$1.16/A2
  Bottom 0.152: 17.14,4.13 18.57,4.13 Q6.2 | 17.14,4.13 11.11,4.13 11.11,25.88 8.26,28.73 v8.26,30.64 | 17.14,4.13 R40.1
S6  (via drill 0.35)
  Top 0.152: v11.43,26.51 6.19,31.75 U$1.15/A1
  Bottom 0.152: 30.48,4.13 31.91,4.13 Q7.2 | 30.48,4.13 23.18,4.13 22.23,5.08 19.05,5.08 19.05,12.54 11.43,20.16 v11.43,26.51 | 30.48,4.13 R42.1
VCC  (via drill 0.35)
  Top 0.152: 16.19,26.51 14.61,26.51 13.81,27.3 R31.2 13.65,27.3 12.22,25.88 6.83,25.88 v6.67,26.04 | 16.19,26.51 17.78,28.1 19.68,28.1 21.59,30 25.08,30 26.04,29.05 T1.12 26.19,28.89 33.5,28.89 T1.13 | 16.19,26.51 v16.35,26.35 | U1.28 16.99,77.47 16.35,77.47 16.03,77.79 15.24,77.79 14.61,78.42 C3.1 14.61,78.58 15.4,79.38 v15.56,79.38 | IC2.2 C12.1 10.16,53.98 12.38,53.98 12.7,54.29 C13.1 12.7,54.45 13.49,55.24 13.49,65.72 | 27.3,66.52 32.38,66.52 33.02,67.15 L1.2 | 12.06,66.52 10.16,66.52 R30.2 | 25.4,66.52 23.5,66.52 R28.2 23.5,66.36 22.86,65.72 13.49,65.72 | 13.49,65.72 12.7,65.72 12.06,66.36 R29.2 12.06,66.52 | 25.4,66.52 27.3,66.52 | 27.3,66.52 R26.2 | 25.4,66.52 R27.2 | v13.02,67.31 12.22,66.52 12.06,66.52
  Bottom 0.152: Q6.1 18.57,2.22 17.14,2.22 R40.2 17.14,2.38 9.53,2.38 9.53,3.81 6.03,7.3 | R38.2 3.81,2.22 5.24,2.22 Q5.1 5.4,2.38 6.03,3.02 6.03,7.3 | Q2.1 5.24,21.27 3.81,21.27 R32.2 | 6.03,7.3 6.03,20.64 5.4,21.27 Q2.1 | R42.2 30.48,2.22 31.91,2.22 Q7.1 32.07,2.38 33.02,3.33 33.02,6.67 31.75,7.94 | 31.75,7.94 31.43,8.26 IC3.16 31.75,7.94 | 33.02,15.56 31.11,15.56 31.11,15.88 IC3.10 | Q4.1 31.91,21.27 30.48,21.27 R36.2 | 33.5,17.78 33.5,19.84 32.07,21.27 Q4.1 | 33.02,15.56 33.5,16.03 33.5,17.78 | 33.02,15.56 C19.1 33.02,15.4 33.81,14.61 33.81,10 31.75,7.94 | 33.5,17.78 C18.1 | Q3.1 18.57,21.27 17.14,21.27 R34.2 17.14,21.43 16.35,22.23 v16.35,26.35 13.97,28.73 13.97,66.36 v13.02,67.31 13.02,76.83 v15.56,79.38 15.24,79.69 OLED1.2 | Q4.1 32.07,21.43 33.34,22.7 33.34,28.73 33.5,28.89 T1.13 | v6.67,26.04 6.67,22.7 5.4,21.43 Q2.1
W5500INT
  Top 0.152: R30.1 10.16,68.26 15.24,73.34 16.99,73.34 U1.36